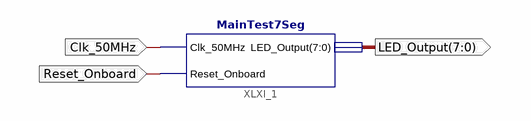
[diagram p0: schematic sheet 1]
// Xilinx ISE schematic adas.sch (spartan6) as structural Verilog: 1 symbols, 3 ports
module adas (
  input  Clk_50MHz,
  input  Reset_Onboard,
  output [7:0] LED_Output
);

  MainTest7Seg XLXI_1 (.Clk_50MHz(Clk_50MHz), .Reset_Onboard(Reset_Onboard), .LED_Output(LED_Output));
endmodule
